# EAGLE design ESQ_CONTROL_ESDV2.0 (EAGLE 9.6.2)
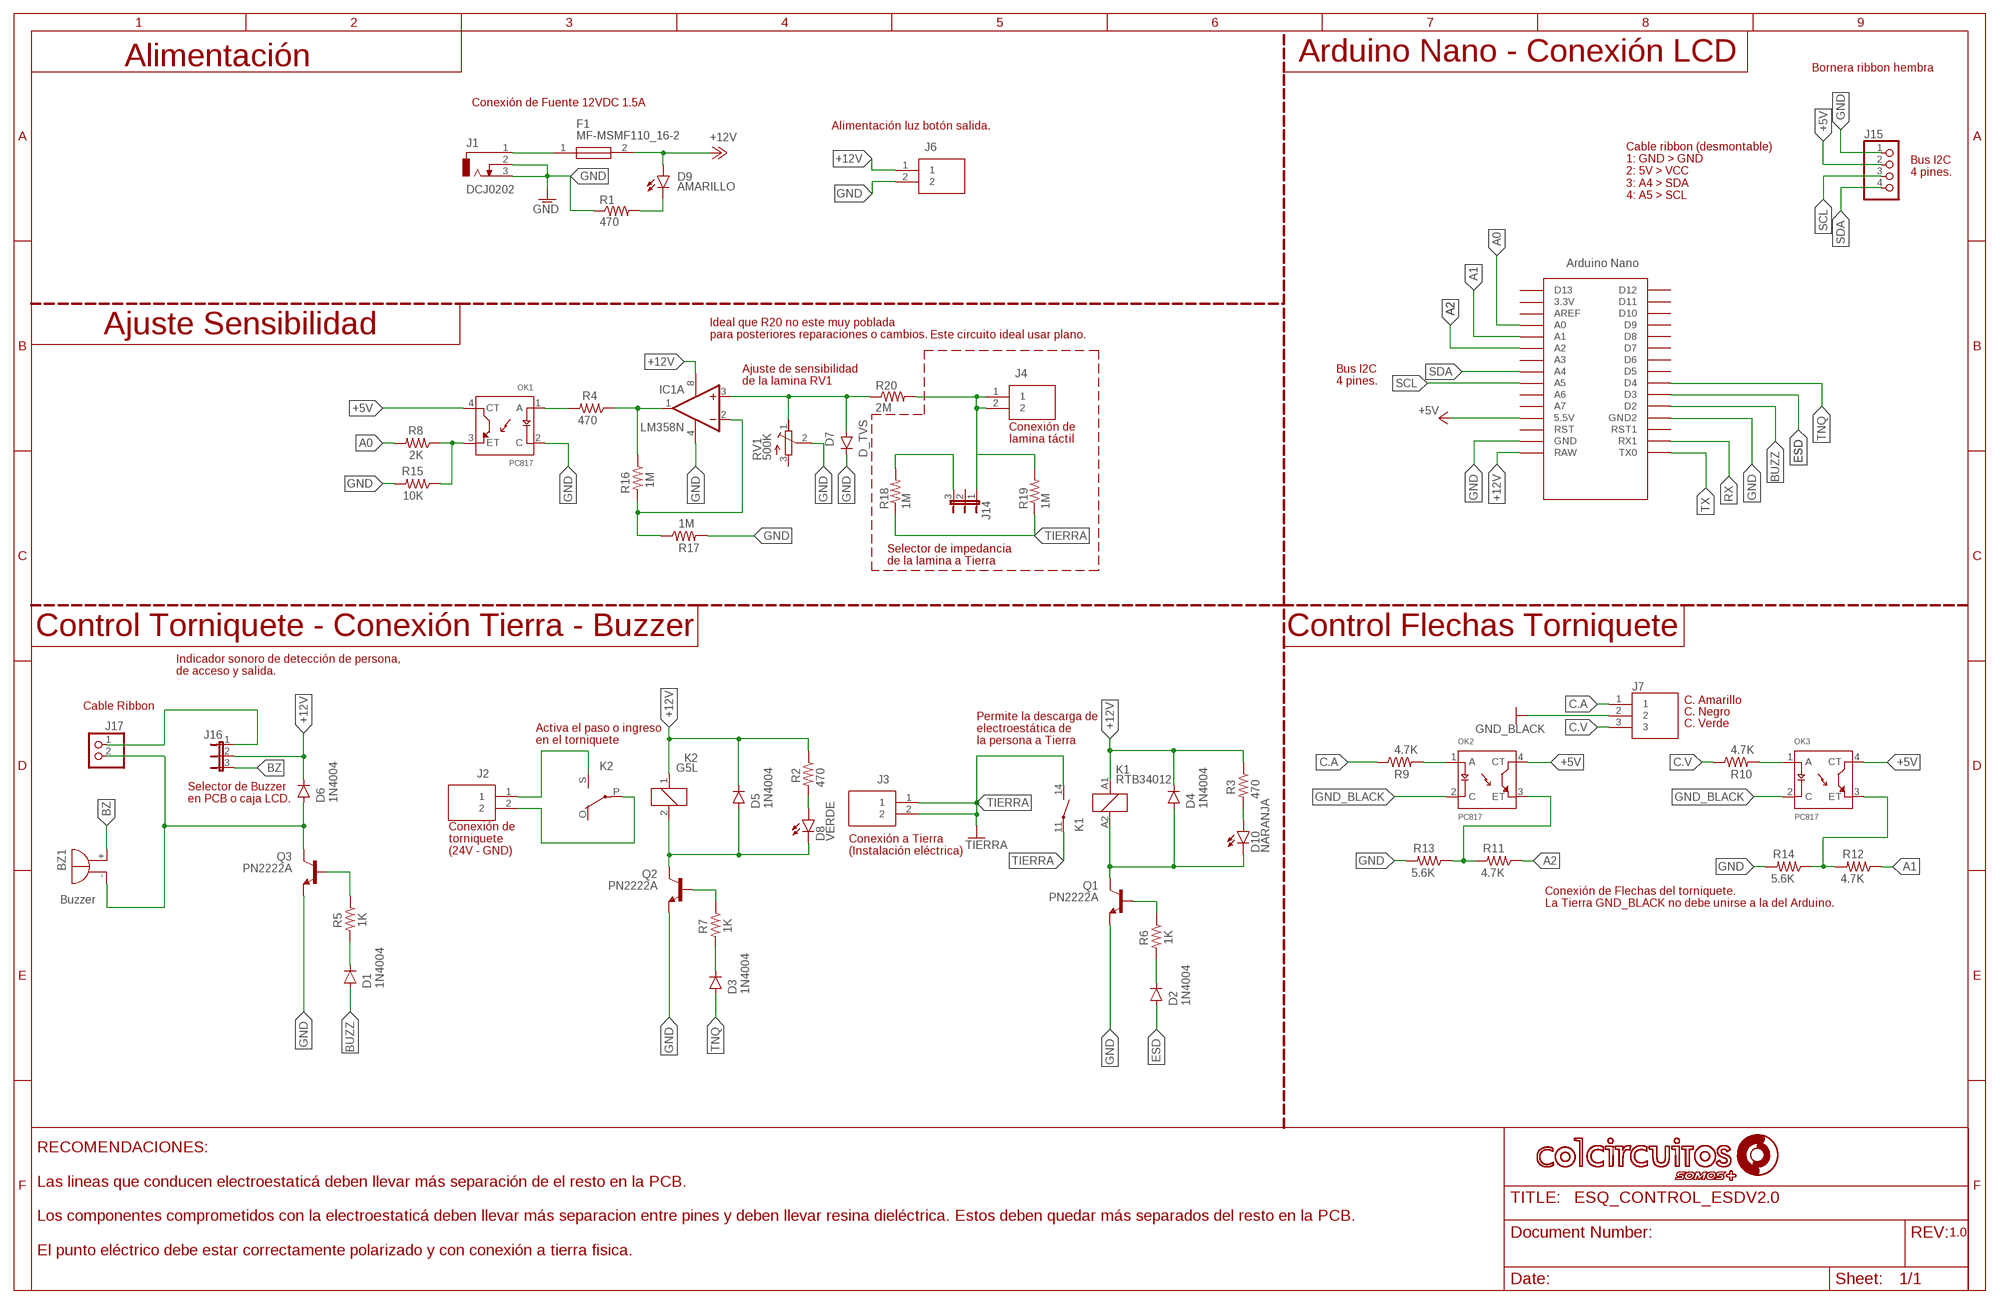
[diagram p0: schematic, sheet 1]

## Parts
BZ1  Buzzer  EB2209A  [EB2209A]
D1  1N4004  [DO41-10]
D2  1N4004  [DO41-10]
D3  1N4004  [DO41-10]
D4  1N4004  [DO41-10]
D5  1N4004  [DO41-10]
D6  1N4004  [DO41-10]
D7  D_TVS  DIODE-DO214AC  [DO214AC]
D8  VERDE  LED5MM  [LED5MM]
D9  AMARILLO  LED5MM  [LED5MM]
D10  NARANJA  LED5MM  [LED5MM]
F1  MF-MSMF110_16-2  [FUSC4632X85N]
IC1  LM358N  [DIL08]
J1  DCJ0202  [DCJ0202]
J2  20020107-H021A01LF  [SHDR2W100P0X508_1X2_1216X850X1]
J3  20020107-H021A01LF  [SHDR2W100P0X508_1X2_1216X850X1]
J4  20020107-H021A01LF  [SHDR2W100P0X508_1X2_1216X850X1]
J6  20020107-H021A01LF  [SHDR2W100P0X508_1X2_1216X850X1]
J7  691311500103  [SHDR3W100P0X508_1X3_1724X850X1]
J14  JP2E  [JP2]
J15  PINHD-1X4  [1X04]
J16  JP2E  [JP2]
J17  PINHD-1X2  [1X02]
K1  RTB34012  [RT-N/O12A3.5]
K2  G5L  [G5LE]
OK1  PC817  PC817X2NIP0F  [SOT254P975X400-4N]
OK2  PC817  PC817X2NIP0F  [SOT254P975X400-4N]
OK3  PC817  PC817X2NIP0F  [SOT254P975X400-4N]
Q1  PN2222A  -NPN-TO92  [TO92]
Q2  PN2222A  -NPN-TO92  [TO92]
Q3  PN2222A  -NPN-TO92  [TO92]
R1  470  R-US_R0805  [R0805]
R2  470  R-US_R0805  [R0805]
R3  470  R-US_R0805  [R0805]
R4  470  R-US_R0805  [R0805]
R5  1K  R-US_R0805  [R0805]
R6  1K  R-US_R0805  [R0805]
R7  1K  R-US_R0805  [R0805]
R8  2K  R-US_R0805  [R0805]
R9  4.7K  R-US_R0805  [R0805]
R10  4.7K  R-US_R0805  [R0805]
R11  4.7K  R-US_R0805  [R0805]
R12  4.7K  R-US_R0805  [R0805]
R13  5.6K  R-US_R0805  [R0805]
R14  5.6K  R-US_R0805  [R0805]
R15  10K  R-US_R0805  [R0805]
R16  1M  R-US_R0805  [R0805]
R17  1M  R-US_R0805  [R0805]
R18  1M  R-US_R1210  [R1210]
R19  1M  R-US_R1210  [R1210]
R20  2M  R-US_R1210  [R1210]
RV1  500K  R-TRIMMT93YA  [RTRIMT93YA]
U$1  NANO  [NANO]

## Nets
+5V: J15.2 OK1.4(CT) OK2.4(CT) OK3.4(CT) U$1.5V(5.5V)
+12V: D4.C D5.C D6.C D9.A F1.2 IC1.8(P:V+) J6.1 J16.2 K1.A1 K2.1 R2.1 R3.1 U$1.RAW
A0: R8.2 U$1.A0
A1: R12.1 U$1.A1
A2: R11.1 U$1.A2
BUZZ: D1.A U$1.D2
BZ: BZ1.+ J16.3
C.A: J7.1 R9.1
C.V: J7.3 R10.1
ESD: D2.A U$1.D3
GND: D7.C IC1.4(P:V-) J1.2 J1.3 J6.2 J15.1 OK1.2(C) Q1.1(E) Q2.1(E) Q3.1(E) R1.1 R13.2 R14.2 R15.2 R17.2 RV1.2(S) U$1.GND U$1.GND1(GND2)
GND_BLACK: J7.2 OK2.2(C) OK3.2(C)
N$1: OK1.3(ET) R8.1 R15.1
N$2: OK1.1(A) R4.2
N$3: IC1.2(A:-IN) R16.2 R17.1
N$4: IC1.1(A:OUT) R4.1 R16.1
N$5: D7.A IC1.3(A:+IN) R20.1 RV1.1(E)
N$6: J14.3 R18.2
N$7: BZ1.- D6.A J17.2 Q3.3(C)
N$8: F1.1 J1.1
N$9: J16.1 J17.1
N$12: D9.K(C) R1.2
N$13: J2.1 K2.S(2:S)
N$14: D5.A D8.K(C) K2.2 Q2.3(C)
N$15: J2.2 K2.P(2:P)
N$16: D8.A R2.2
N$17: D3.C R7.2
N$18: Q2.2(B) R7.1
N$19: D4.A D10.K(C) K1.A2 Q1.3(C)
N$20: D2.C R6.2
N$21: Q1.2(B) R6.1
N$22: OK2.1(A) R9.2
N$23: OK2.3(ET) R11.2 R13.1
N$24: OK3.3(ET) R12.2 R14.1
N$25: D10.A R3.2
N$26: OK3.1(A) R10.2
N$27: J4.1 J4.2 J14.1 R19.2 R20.2
N$28: Q3.2(B) R5.1
N$29: D1.C R5.2
RX: U$1.RX1
SCL: J15.3 U$1.A5
SDA: J15.4 U$1.A4
TIERRA: J3.1 J3.2 K1.11(2:P) K1.14(2:S) R18.1 R19.1
TNQ: D3.A U$1.D4
TX: U$1.TX0
Unconnected: IC1.5(B:+IN) IC1.6(B:-IN) IC1.7(B:OUT) J14.2 K2.O(2:O) RV1.3(A) U$1.3.3V U$1.A3 U$1.A6 U$1.A7 U$1.AREF U$1.D5 U$1.D6 U$1.D7 U$1.D8 U$1.D9 U$1.D10 U$1.D11 U$1.D12 U$1.D13 U$1.ICSP1 U$1.ICSP2 U$1.ICSP3 U$1.ICSP4 U$1.ICSP5 U$1.ICSP6 U$1.RST U$1.RST1

## Notes on the sheet
- Alimentación | Arduino Nano - Conexión LCD
- Bornera ribbon hembra
- Conexión de Fuente 12VDC 1.5A
- Alimentación luz botón salida.
- Bus I2C
  4 pines.
- Cable ribbon (desmontable)
  1: GND > GND
  2: 5V > VCC
  3: A4 > SDA
  4: A5 > SCL
- Ajuste Sensibilidad
- Ideal que R20 no este muy poblada
  para posteriores reparaciones o cambios.
- Este circuito ideal usar plano.
- Ajuste de sensibilidad
  de la lamina RV1
- Bus I2C
  4 pines.
- Conexión de
  lamina táctil
- Selector de impedancia
  de la lamina a Tierra
- Control Torniquete - Conexión Tierra - Buzzer | Control Flechas Torniquete
- Indicador sonoro de detección de persona,
  de acceso y salida.
- C. Amarillo
- Cable Ribbon
- C. Negro
- C. Verde
- Permite la descarga de
  electroestática de 
  la persona a Tierra
- Activa el paso o ingreso
  en el torniquete
- Selector de Buzzer
  en PCB o caja LCD.
- Conexión de 
  torniquete
  (24V - GND)
- Conexión a Tierra
  (Instalación eléctrica)
- Conexión de Flechas del torniquete.
  La Tierra GND_BLACK no debe unirse a la del Arduino.
- 1.0
- RECOMENDACIONES:
  
  Las lineas que conducen electroestaticá deben llevar más separación de el resto en la PCB.
  
  Los componentes comprometidos con la electroestaticá deben llevar más separacion entre pines y deben llevar resina dieléctrica. Estos deben quedar más separados del resto en la PCB.
  
  El punto eléctrico debe estar correctamente polarizado y con conexión a tierra fisica.

## Library data of the parts
BZ1 = buzzer:EB2209A: BUZZER Source: Buerklin; OC_FARNELL: unknown; OC_NEWARK: unknown
D1-D6 = diode:1N4004: DIODE general purpose rectifier, 1 A
D7 = diode:DIODE-: DIODE
D8-D10 = led:LED: LED OSRAM: - CHIPLED LG R971, LG N971, LY N971, LG Q971, LY Q971, LO R971, LY R971 LH N974, LH R974 LS Q976, LO Q976, LY Q976 LO Q996 - Hyper CHIPLED LW Q18S LB Q993, LB Q99A, LB R99A - SideLED LS A670, LO A670, LY A670, LG A670, LP A670 LB A673, LV A673, LT A673, LW A673 LH A674 LY A675 LS A676, LA A676, LO A676, LY A676, LW A676 LS A679, LY A679, LG A679 - Hyper Micro SIDELED® LS Y876, LA Y876, LO Y876, LY Y876 LT Y87S - SmartLED LW L88C, LW L88S LB L89C, LB L89S, LG L890 LS L89K, LO L89K, LY L89K LS L896, LA L896, LO L896, LY L896 - TOPLED LS T670, LO T670, LY T670, LG T670, LP T670 LSG T670, LSP T670, LSY T670, LOP T670, LYG T670 LG T671, LOG T671, LSG T671 LB T673, LV T673, LT T673, LW T673 LH T674 LS T676, LA T676, LO T676, LY T676, LB T676, LH T676, LSB T676, LW T676 LB T67C, LV T67C, LT T67C, LS T67K, LO T67K, LY T67K, LW E67C LS E67B, LA E67B, LO E67B, LY E67B, LB E67C, LV E67C, LT E67C LW T67C LS T679, LY T679, LG T679 LS T770, LO T770, LY T770, LG T770, LP T770 LB T773, LV T773, LT T773, LW T773 LH T774 LS E675, LA E675, LY E675, LS T675 LS T776, LA T776, LO T776, LY T776, LB T776 LHGB T686 LT T68C, LB T68C - Hyper Mini TOPLED® LB M676 - Mini TOPLED Santana® LG M470 LS M47K, LO M47K, LY M47K Source: http://www.osram.convergy.de LUXEON: - LUMILED® LXK2-PW12-R00, LXK2-PW12-S00, LXK2-PW14-U00, LXK2-PW14-V00 LXK2-PM12-R00, LXK2-PM12-S00, LXK2-PM14-U00 LXK2-PE12-Q00, LXK2-PE12-R00, LXK2-PE12-S00, LXK2-PE14-T00, LXK2-PE14-U00 LXK2-PB12-K00, LXK2-PB12-L00, LXK2-PB12-M00, LXK2-PB14-N00, LXK2-PB14-P00, LXK2-PB14-Q00 LXK2-PR12-L00, LXK2-PR12-M00, LXK2-PR14-Q00, LXK2-PR14-R00 LXK2-PD12-Q00, LXK2-PD12-R00, LXK2-PD12-S00 LXK2-PH12-R00, LXK2-PH12-S00 LXK2-PL12-P00, LXK2-PL12-Q00, LXK2-PL12-R00 Source: www.luxeon.com KINGBRIGHT: KA-3528ASYC Source: www.kingbright.com
F1 = MF-MSMF110_16-2:MF-MSMF110_16-2: Fuse, PTC, Resettable, SMD,1812,1.1A,16V Bourns 1.1A Surface Mount Resettable Fuse, 16 V Source: Datasheet <https://componentsearchengine.com/Datasheets/2/MF-MSMF110_16-2.pdf>; ARROW_PART_NUMBER: MF-MSMF110/16-2; ARROW_PRICE-STOCK: https://www.arrow.com/en/products/mf-msmf11016-2/bourns?region=europe; DESCRIPTION: Fuse, PTC, Resettable, SMD,1812,1.1A,16V Bourns 1.1A Surface Mount Resettable Fuse, 16 V; HEIGHT: 0.85mm; MANUFACTURER_NAME: Bourns; MANUFACTURER_PART_NUMBER: MF-MSMF110/16-2; MOUSER_PART_NUMBER: 652-MF-MSMF110/16-2; MOUSER_PRICE-STOCK: https://www.mouser.co.uk/ProductDetail/Bourns/MF-MSMF110-16-2?qs=wksszfECgvir54ST3ixUHA%3D%3D
IC1 = linear:LM358: OP AMP also LM158; LM258; LM2904 Source: http://cache.national.com/ds/LM/LM158.pdf
J1 = con-jack:DCJ0202: DC POWER JACK Source: DCJ0202.pdf; OC_FARNELL: unknown; OC_NEWARK: unknown
J2-J4 J6 = 20020107-H021A01LF:20020107-H021A01LF: Pluggable Terminal Blocks 2P 5.08MM HDR STR PLUGGABLE TERM BLK Source: Datasheet <https://www.mouser.co.uk/datasheet/2/18/20020107-1652744.pdf>; DESCRIPTION: Pluggable Terminal Blocks 2P 5.08MM HDR STR PLUGGABLE TERM BLK; HEIGHT: 12.15mm; MANUFACTURER_NAME: Amphenol; MANUFACTURER_PART_NUMBER: 20020107-H021A01LF; MOUSER_PART_NUMBER: 649-220107-H021A01LF; MOUSER_PRICE-STOCK: https://www.mouser.co.uk/ProductDetail/Amphenol-Anytek/20020107-H021A01LF?qs=qY18JiHxGVuqDyqLdtu4UA%3D%3D
J7 = 691311500103:691311500103: Wurth Elektronik 311 Series 5.08mm Pitch Straight Pluggable Terminal Block, PCB Header, Through Hole, 3 Way Source: Datasheet <https://www.we-online.de/katalog/datasheet/6913115001xx.pdf>; DESCRIPTION: Wurth Elektronik 311 Series 5.08mm Pitch Straight Pluggable Terminal Block, PCB Header, Through Hole, 3 Way; HEIGHT: 12mm; MANUFACTURER_NAME: Wurth Elektronik; MANUFACTURER_PART_NUMBER: 691311500103; MOUSER_PART_NUMBER: 710-691311500103; MOUSER_PRICE-STOCK: https://www.mouser.co.uk/ProductDetail/Wurth-Elektronik/691311500103?qs=2kOmHSv6VfTr95JPv5RlIw%3D%3D
J14 J16 = jumper:JP2E: JUMPER
J15 = pinhead:PINHD-1X4: PIN HEADER
J17 = pinhead:PINHD-1X2: PIN HEADER
K1 = relay:RT?*: Power PCB Relay SCHRACK 1 pole 12 / 16 A, DC- or AC-coil Source: http://www.schrack.com/.. 5819.pdf; MPN: RTB34012
K2 = relay:G5L: RELAY 1 x switch, 10 A/120 V AC, 8 A/30 V ADC, Omron
OK1-OK3 = PC817X2NIP0F:PC817X2NIP0F: PC817 Series 1 Channel 80 V 5000 Vrms General Purpose Photocoupler - DIP-4 Check availability <https://pricing.snapeda.com/parts/PC817X2NIP0F/Sharp%20Microelectronics/view-part?ref=eda>; AVAILABILITY: In Stock; DESCRIPTION: Optoisolator Transistor Output 5000Vrms 1 Channel 4-SMD; MF: Sharp Microelectronics; MP: PC817X2NIP0F; PACKAGE: SMD-4 Sharp; PRICE: None; PURCHASE-URL: https://pricing.snapeda.com/search?q=PC817X2NIP0F&ref=eda
Q1-Q3 = transistor:*-NPN-: NPN Transistror BF959 corrected 2008.03.06
R1-R20 = rcl:R-US_: RESISTOR, American symbol; SPICEPREFIX: R
RV1 = rcl:R-TRIMM: Trimm resistor; SPICEMODEL: X; SPICEPREFIXL: POT
U$1 = Arduino-clone:NANO: Arduino Nano

## Board
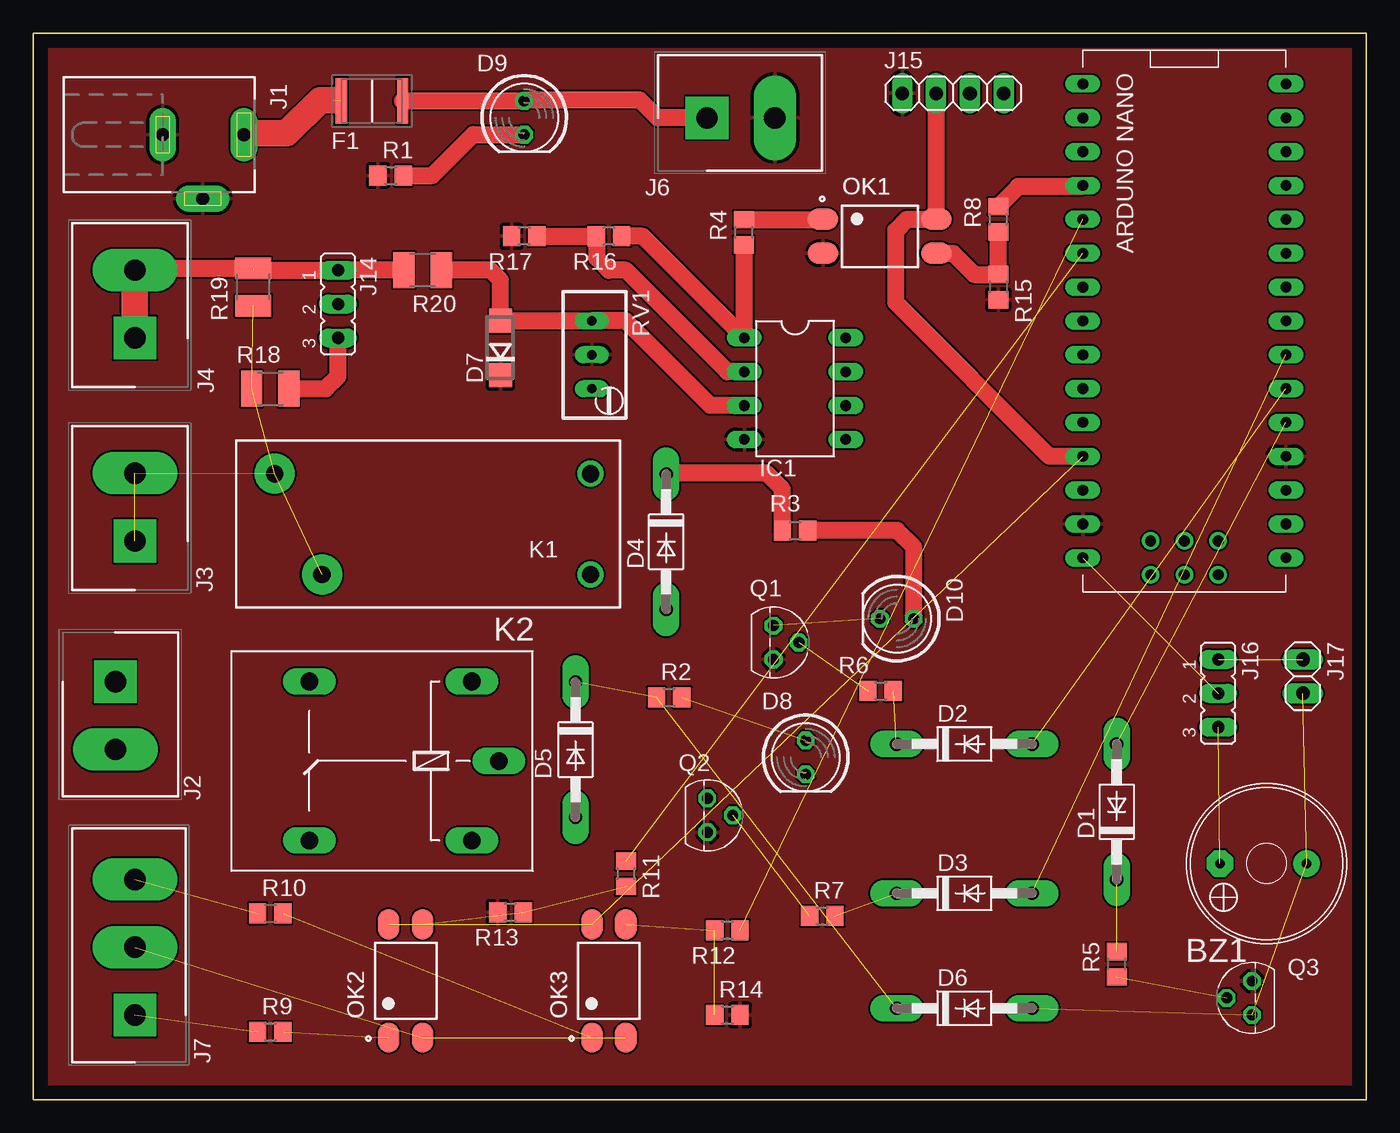
[diagram p1: board, top side]
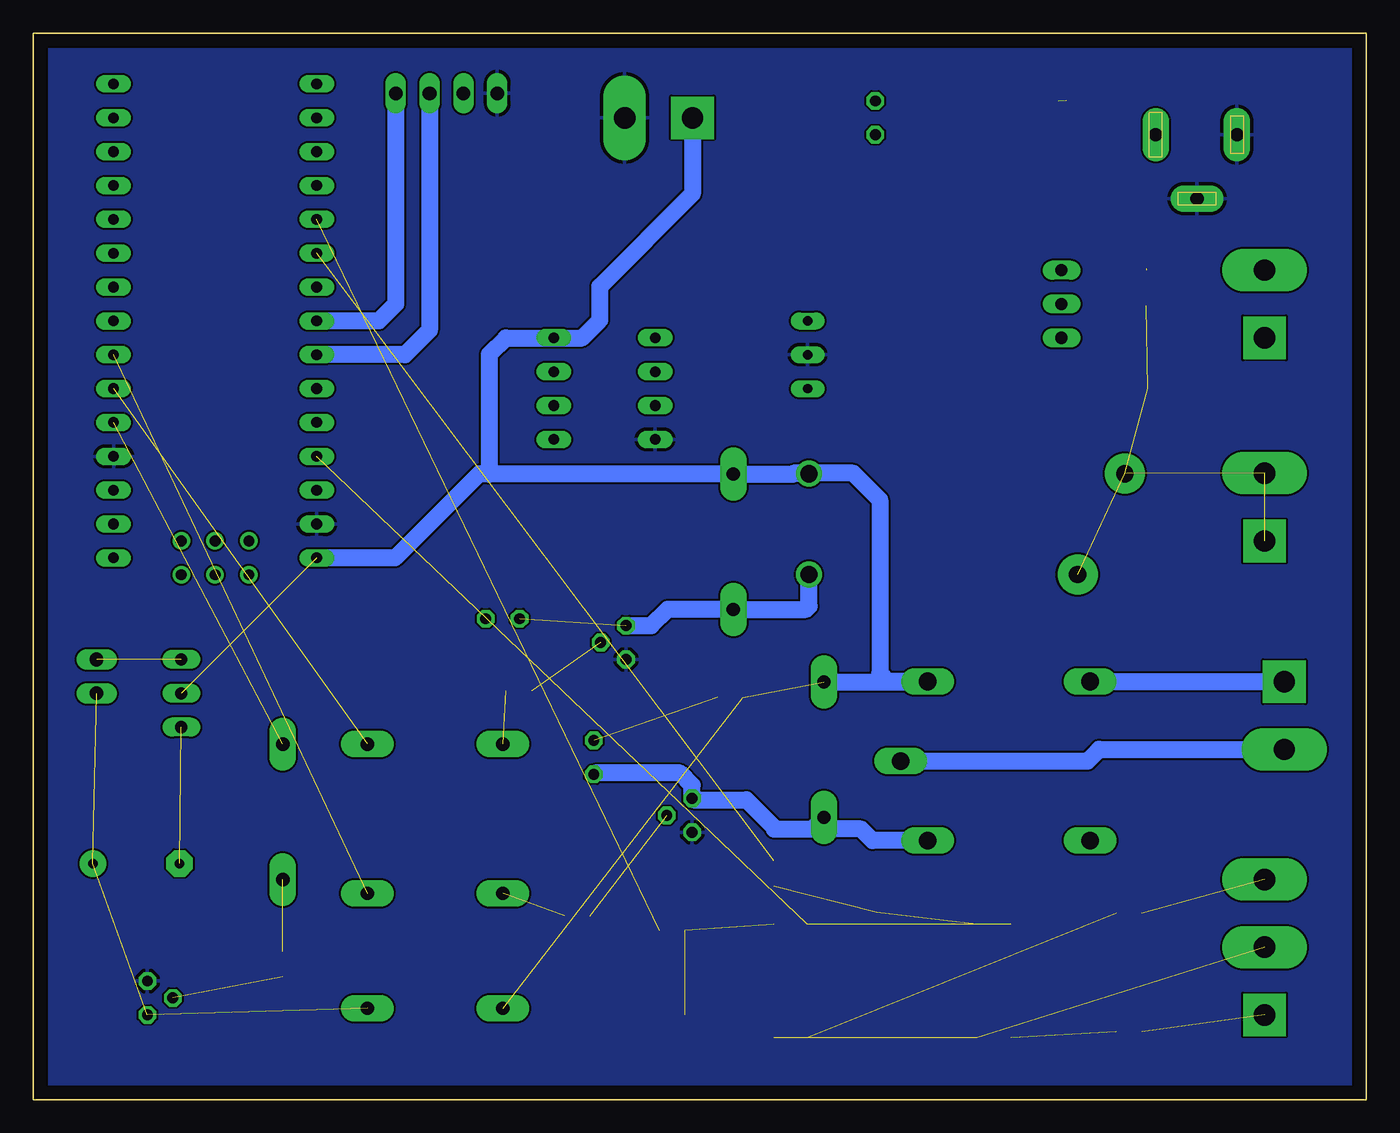
[diagram p2: board, bottom side, seen from below]

Size 100 x 80 mm. Coordinates in mm from the lower left corner, seen from the top.
Outline: 0,80 100,80 100,0 0,0 0,80
Copper layers (1*16): Top 0.035mm / dielectric 1.5mm / Bottom 0.035mm
Design rules "default": minimum track width 6mil, minimum drill 0.35mm, track to track 6mil, track to pad 6mil, pad to pad 6mil, via to via 6mil, smd to smd 6mil, copper to edge 40mil, drill to drill 6mil, minimum pad ring 10mil, minimum via ring 8mil, stop-mask expansion 4mil, vias tented up to drill 0mil, thermal gap 10mil

### Footprints (pad centres in the part's own frame; a part is rotated, then mirrored left to right if it is on the bottom)
EB2209A = drill 0.7 pad 2 octagon: + 3.5,0 | drill 0.7 pad 2: - -3,0
DO41-10 = drill 1 pad 2 long: A 5.08,0; C -5.08,0
DO214AC = smd 1.8 x 1.7: A 2.05,0; C -2.05,0
LED5MM = drill 0.813 octagon: A -1.27,0; K 1.27,0
FUSC4632X85N = smd 0.85 x 3.43: 1 -2.3,0; 2 2.3,0
DIL08 = drill 0.8 pad 1.27 long: 1 -3.81,-3.81; 2 -1.27,-3.81; 3 1.27,-3.81; 4 3.81,-3.81; 5 3.81,3.81; 6 1.27,3.81; 7 -1.27,3.81; 8 -3.81,3.81
DCJ0202 = drill 1 pad 2 long: 1 0,3.1; 2 4.8,0; 3 0,-3
SHDR2W100P0X508_1X2_1216X850X1 = drill 1.6 pad 3.2 square: 1 0,0 | drill 1.6 pad 3.2 long: 2 5.08,0
SHDR3W100P0X508_1X3_1724X850X1 = drill 1.6 pad 3.2 square: 1 0,0 | drill 1.6 pad 3.2 long: 2 5.08,0; 3 10.16,0
JP2 = drill 0.914 long: 1 -2.54,0; 2 0,0; 3 2.54,0
1X04 = drill 1.016 long: 1 -3.81,0; 2 -1.27,0; 3 1.27,0; 4 3.81,0
1X02 = drill 1.016 long: 1 -1.27,0; 2 1.27,0
RT-N/O12A3.5 = drill 1.3 pad 3: 11 7.56,3.78; 14 11.1,-3.78 | drill 1.3: A1 -12.6,-3.78; A2 -12.6,3.78
G5LE = drill 1.321 long: 1 -7.493,-5.969; 2 -7.493,5.969; O 4.699,5.969; P -9.525,0; S 4.699,-5.969
SOT254P975X400-4N = smd 2.25 x 1.6: 1 -4.25,1.27; 2 -4.25,-1.27; 3 4.25,-1.27; 4 4.25,1.27
TO92 = drill 0.813 octagon: 1 1.27,0; 2 0,1.905; 3 -1.27,0
R0805 = smd 1.3 x 1.5: 1 -0.95,0; 2 0.95,0
R1210 = smd 1.6 x 2.7: 1 -1.4,0; 2 1.4,0
RTRIMT93YA = drill 0.7 pad 1.27 long: 1 0,-2.54; 2 0,0; 3 0,2.54
NANO = drill 0.8 long: 3.3V -10.16,24.13; 5V -10.16,-1.27; A0 -10.16,19.05; A1 -10.16,16.51; A2 -10.16,13.97; A3 -10.16,11.43; A4 -10.16,8.89; A5 -10.16,6.35; A6 -10.16,3.81; A7 -10.16,1.27; AREF -10.16,21.59; D2 5.08,1.27; D3 5.08,3.81; D4 5.08,6.35; D5 5.08,8.89; D6 5.08,11.43; D7 5.08,13.97; D8 5.08,16.51; D9 5.08,19.05; D10 5.08,21.59; D11 5.08,24.13; D12 5.08,26.67; D13 -10.16,26.67; GND -10.16,-6.35; GND1 5.08,-1.27; RAW -10.16,-8.89; RST -10.16,-3.81; RST1 5.08,-3.81; RX1 5.08,-6.35; TX0 5.08,-8.89 | drill 0.8: ICSP1 -5.08,-10.16; ICSP2 -5.08,-7.62; ICSP3 -2.54,-10.16; ICSP4 -2.54,-7.62; ICSP5 0,-10.16; ICSP6 0,-7.62

### Placement (x,y rotation side)
BZ1  92.53,17.71 180 top
D1  81.28,21.59 90 top
D2  69.85,26.67 0 top
D3  69.85,15.47 0 top
D4  47.48,41.85 270 top
D5  40.68,26.25 270 top
D6  69.85,6.85 0 top
D7  35.05,56.39 90 top
D8  57.95,25.67 270 top
D9  36.83,73.66 270 top
D10  64.79,36.08 180 top
F1  25.4,74.93 0 top
IC1  57.15,53.34 270 top
J1  12.7,72.39 270 top
J2  6.15,31.35 270 top
J3  7.62,41.91 90 top
J4  7.62,57.15 90 top
J6  50.55,73.66 0 top
J7  7.62,6.35 90 top
J14  22.86,59.69 270 top
J15  69,75.5 0 top
J16  88.9,30.48 270 top
J17  95.25,31.75 270 top
K1  29.21,43.18 180 top
K2  25.4,25.4 180 top
OK1  63.5,64.77 0 top
OK2  27.94,8.89 90 top
OK3  43.18,8.89 90 top
Q1  55.53,34.29 270 top
Q2  50.57,21.32 270 top
Q3  91.44,7.62 90 top
R1  26.81,69.33 0 top
R2  47.71,30.18 0 top
R3  57.15,42.68 0 top
R4  53.31,65.07 90 top
R5  81.28,10.16 90 top
R6  63.57,30.67 0 top
R7  59.19,13.78 0 top
R8  72.39,66.04 90 top
R9  17.78,5.08 0 top
R10  17.78,13.97 0 top
R11  44.45,16.95 270 top
R12  52.07,12.7 180 top
R13  35.8,14.06 180 top
R14  52.07,6.35 0 top
R15  72.39,60.96 270 top
R16  43.18,64.77 180 top
R17  36.83,64.77 180 top
R18  17.78,53.34 0 top
R19  16.51,60.96 90 top
R20  29.21,62.23 180 top
RV1  41.91,55.88 180 top
U$1  88.9,49.53 0 top

### Tracks (layer width: path | path; a pad name or v marks a point on that pad's centre or on a via)
+5V  (2 unrouted)
  Top 1.27: U$1.5V 76.24,48.26 64.7,59.8 64.7,65.2 65.54,66.04 OK1.4 67.75,75.48 J15.2
+12V  (3 unrouted)
  Top 1.27: R3.1 56.2,45.8 55,47 47.55,47 D4.C | F1.2 D9.A 36.9,75 45.5,75 46.84,73.66 J6.1
  Bottom 1.27: J6.1 50.55,67.95 57.5,61 57.5,58.5 58.85,57.15 IC1.8 64.55,57.15 65.77,55.93 65.77,46.93 | U$1.RAW 72.86,40.64 66.57,46.93 | K1.A1 43,46.96 | 66.54,46.96 66.57,46.93 | K2.1 34,31.37 | 34,31.37 35.87,31.37 36.5,32 36.5,45 38.5,47 42.96,47 43,46.96 | 43,46.96 43.03,46.93 D4.C 65.77,46.93 | 65.77,46.93 66.57,46.93 | D5.C 34.04,31.33 34,31.37
A0
  Top 1.27: U$1.A0 78.66,68.5 73.9,68.5 R8.2
A1  (1 unrouted)
A2  (1 unrouted)
BUZZ  (1 unrouted)
BZ  (1 unrouted)
C.A  (1 unrouted)
C.V  (1 unrouted)
ESD  (1 unrouted)
GND
  pour Top: 0.5,79.5 99.5,79.5 99.5,0.5 0.5,0.5
  pour Bottom: 0.5,79.5 0.5,0.5 99.5,0.5 99.5,79.5
GND_BLACK  (2 unrouted)
N$1
  Top 1.27: R8.1 R15.1 70.59,61.91 69,63.5 OK1.3
N$2
  Top 1.27: R4.2 59.23,66.02 OK1.1
N$3
  Top 1.27: R17.1 R16.2 42.29,64.71 42.29,63.12 43.18,62.23 44.45,62.23 52.07,54.61 IC1.2
N$4
  Top 1.27: R16.1 45.72,64.77 IC1.1 53.34,64.09 R4.1
N$5
  Top 1.27: R20.1 34.29,62.23 35.05,61.47 D7.A 41.89,58.44 | 41.89,58.44 RV1.1 | IC1.3 50.8,52.07 44.43,58.44 41.89,58.44
N$6
  Top 1.27: R18.2 21.94,53.34 22.86,54.26 J14.3
N$7  (3 unrouted)
N$8  (1 unrouted)
  Top 2: J1.1 15.91,72.5 19,72.5 21.5,75 22.5,75
N$9  (1 unrouted)
N$12
  Top 1.27: R1.2 29.93,69.33 33,72.4 D9.K
N$13
  Bottom 1.27: J2.1 20.68,31.35 K2.S
N$14
  Bottom 1.27: K2.2 37.03,19.43 37.9,20.3 41.55,20.3 | 41.55,20.3 D5.A | 41.55,20.3 44.4,20.3 44.4,20.4 46.5,22.5 50.48,22.5 Q2.3 50.57,23.57 51.5,24.5 57.85,24.5 D8.K
N$15
  Bottom 1.27: K2.P 20.9,25.4 20.03,26.27 J2.2
N$16  (1 unrouted)
N$17  (1 unrouted)
N$18  (1 unrouted)
N$19  (1 unrouted)
  Bottom 1.27: K1.A2 41.8,37 42.03,36.77 D4.A 47.51,36.8 52.4,36.8 53.64,35.56 Q1.3
N$20  (1 unrouted)
N$21  (1 unrouted)
N$22  (1 unrouted)
N$23  (2 unrouted)
N$24  (2 unrouted)
N$25
  Top 1.27: R3.2 58.12,42.7 63.5,42.7 64.42,42.7 64.8,42.7 66.06,41.44 D10.A
N$26  (1 unrouted)
N$27  (1 unrouted)
  Top 1.27: R19.2 7.75,62.36 J4.2 | 16.51,62.23 J14.1 R20.2
  Top 2: J4.1 J4.2
N$28  (1 unrouted)
N$29  (1 unrouted)
SCL
  Bottom 1.27: J15.3 70.27,57.73 72.12,55.88 U$1.A5
SDA
  Bottom 1.27: J15.4 72.81,59.69 74.08,58.42 U$1.A4
TIERRA  (5 unrouted)
TNQ  (1 unrouted)